# Altium schematic sheet power.SchDoc
size A4
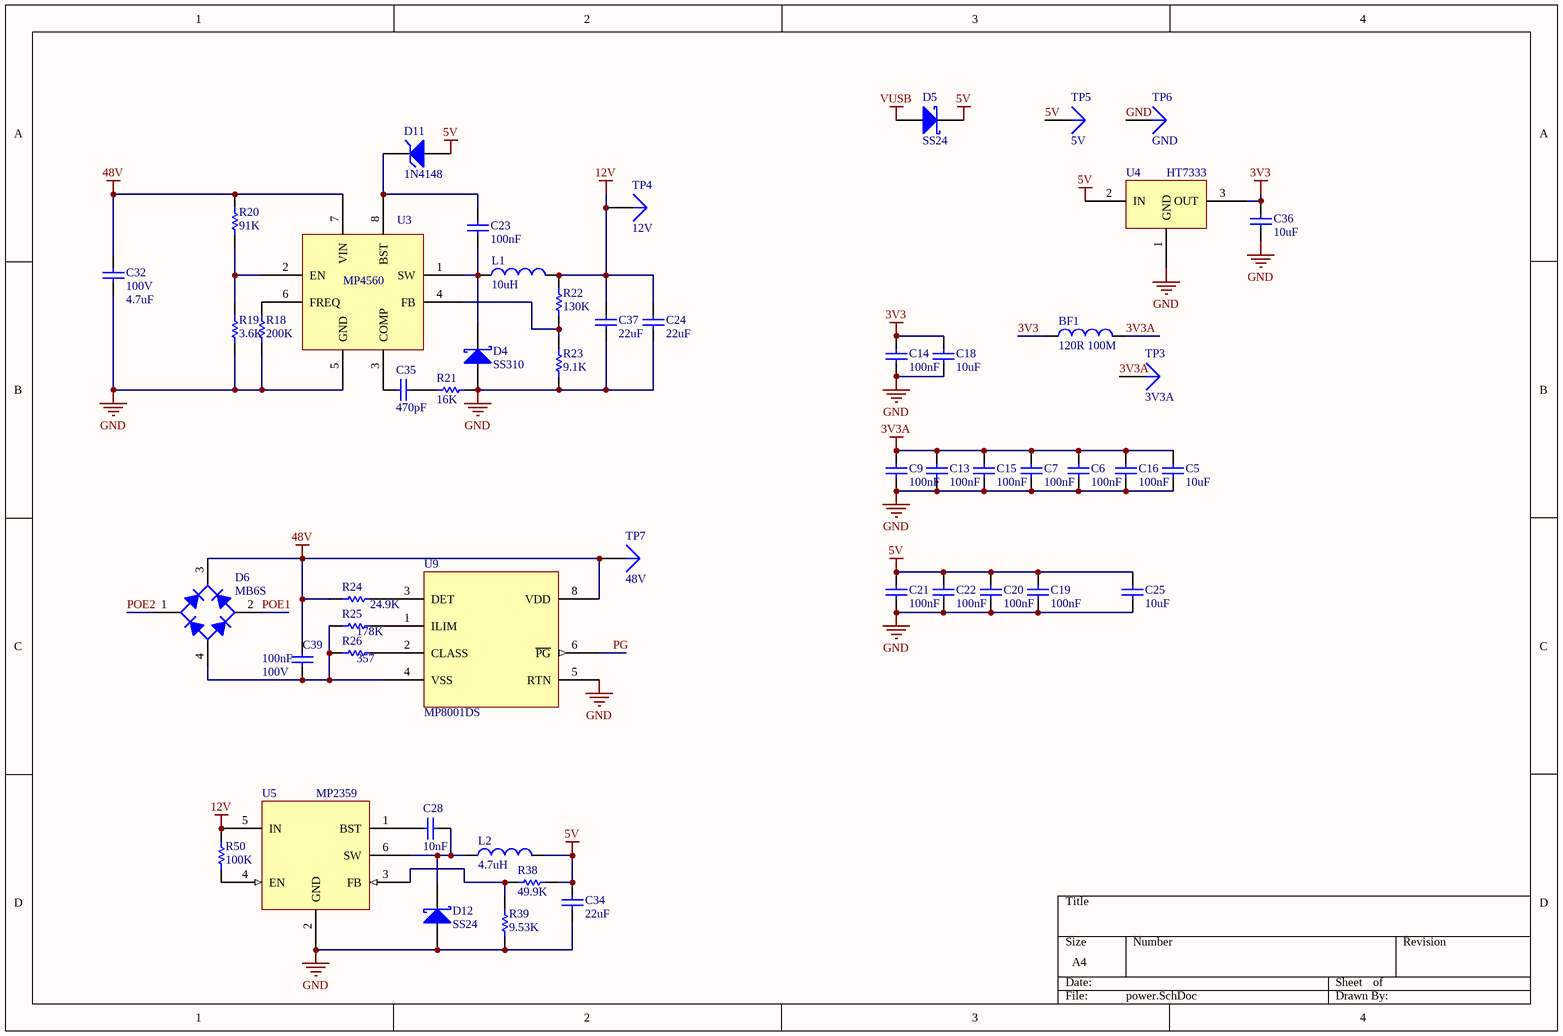
[diagram p0: power.SchDoc]

## Parts
BF1  value 120R 100M  [L-1608[0603]]  (hidden comment: GZ1608D121TF)
C5  value 10uF  [C-1608[0603]]  (hidden comment: Cap Semi)
C6  value 100nF  [C-1608[0603]]  (hidden comment: Cap Semi)
C7  value 100nF  [C-1608[0603]]  (hidden comment: Cap Semi)
C9  value 100nF  [C-1608[0603]]  (hidden comment: Cap Semi)
C13  value 100nF  [C-1608[0603]]  (hidden comment: Cap Semi)
C14  value 100nF  [C-1608[0603]]  (hidden comment: Cap Semi)
C15  value 100nF  [C-1608[0603]]  (hidden comment: Cap Semi)
C16  value 100nF  [C-1608[0603]]  (hidden comment: Cap Semi)
C18  value 10uF  [C-1608[0603]]  (hidden comment: Cap Semi)
C19  value 100nF  [C-1608[0603]]  (hidden comment: Cap Semi)
C20  value 100nF  [C-1608[0603]]  (hidden comment: Cap Semi)
C21  value 100nF  [C-1608[0603]]  (hidden comment: Cap Semi)
C22  value 100nF  [C-1608[0603]]  (hidden comment: Cap Semi)
C23  value 100nF  [C-1608[0603]]  (hidden comment: Cap Semi)
C24  value 22uF  [CAPC3225L]  (hidden comment: Cap Semi)
C25  value 10uF  [C-1608[0603]]  (hidden comment: Cap Semi)
C28  value 10nF  [C-1608[0603]]  (hidden comment: Cap Semi)
C32  100V  value 4.7uF  [CAPC3216L]
C34  value 22uF  [CAPC2512L]  (hidden comment: Tantalum)
C35  value 470pF  [C-1608[0603]]  (hidden comment: Cap Semi)
C36  value 10uF  [CAPC2512L]  (hidden comment: Tantalum)
C37  value 22uF  [CAPC3225L]  (hidden comment: Cap Semi)
C39  100V  value 100nF  [C-2012[0805]]
D4  SS310  [DO-214AC]
D5  SS24  [DO-214AC]
D6  MB6S  [MB6S]
D11  1N4148  [LL-34]
D12  SS24  [DO-214AC]
L1  value 10uH  [L-5040]  (hidden comment: Inductor)
L2  value 4.7uH  [INDC4532N]  (hidden comment: Inductor)
R18  value 200K  [R-1608[0603]]  (hidden comment: Res Semi)
R19  value 3.6K  [R-1608[0603]]  (hidden comment: Res Semi)
R20  value 91K  [R-1608[0603]]  (hidden comment: Res Semi)
R21  value 16K  [R-1608[0603]]  (hidden comment: Res Semi)
R22  value 130K  [R-1608[0603]]  (hidden comment: Res Semi)
R23  value 9.1K  [R-1608[0603]]  (hidden comment: Res Semi)
R24  value 24.9K  [R-2012[0805]]  (hidden comment: 1/4W)
R25  value 178K  [R-1608[0603]]  (hidden comment: Res Semi)
R26  value 357  [R-1608[0603]]  (hidden comment: Res Semi)
R38  value 49.9K  [R-1608[0603]]  (hidden comment: Res Semi)
R39  value 9.53K  [R-1608[0603]]  (hidden comment: Res Semi)
R50  value 100K  [R-1608[0603]]  (hidden comment: Res Semi)
TP3  3V3A  [TESTPOINT]
TP4  12V  [TESTPOINT]
TP5  5V  [TESTPOINT]
TP6  GND  [TESTPOINT]
TP7  48V  [TESTPOINT]
U3  MP4560  [MP1584]  (value not drawn)
U4  HT7333  [SOT89]
U5  MP2359  [SOT23-6]
U9  MP8001DS  [SOIC_E150_8]

## Nets
3V3: BF1.1 C14.2 C18.2 C36.1 U4.3(OUT)
3V3A: BF1.2 C5.2 C6.2 C7.2 C9.2 C13.2 C15.2 C16.2 TP3.1
5V: C19.2 C20.2 C21.2 C22.2 C25.2 C34.1 D5.2(K) D11.1(A) L2.2 R38.1 TP5.1 U4.2(IN)
12V: C24.1 C37.1 L1.2 R22.2 R50.1 TP4.1 U5.5(IN)
48V: C32.2 C39.2 D6.3(K) R20.2 R24.2 TP7.1 U3.7(VIN) U9.8(VDD)
GND: C5.1 C6.1 C7.1 C9.1 C13.1 C14.1 C15.1 C16.1 C18.1 C19.1 C20.1 C21.1 C22.1 C24.2 C25.1 C32.1 C34.2 C36.2 C37.2 D4.1(A) D12.1(A) R18.1 R19.1 R21.1 R23.1 R39.1 TP6.1 U3.5(GND) U4.1(GND) U5.2(GND) U9.5(RTN)
VUSB: D5.1(A)
PG: U9.6(~{PG})
POE1: D6.2(C)
POE2: D6.1(C)
NetC23_1: C23.1 D4.2(K) L1.1 U3.1(SW)
NetC23_2: C23.2 D11.2(K) U3.8(BST)
NetC28_1: C28.1 U5.1(BST)
NetC28_2: C28.2 D12.2(K) L2.1 U5.6(SW)
NetC35_1: C35.1 U3.3(COMP)
NetC35_2: C35.2 R21.2
NetC39_1: C39.1 D6.4(A) R25.2 R26.2 U9.4(VSS)
NetR18_2: R18.2 U3.6(FREQ)
NetR19_2: R19.2 R20.1 U3.2(EN)
NetR22_1: R22.1 R23.2 U3.4(FB)
NetR24_1: R24.1 U9.3(DET)
NetR25_1: R25.1 U9.1(ILIM)
NetR26_1: R26.1 U9.2(CLASS)
NetR38_2: R38.2 R39.2 U5.3(FB)
NetR50_2: R50.2 U5.4(EN)

## Library data of the parts
BF1 L1 L2 = Inductor: Code_IEC: 1005; Published: 8-Jun-2000; LatestRevisionDate: 29-May-2009; LatestRevisionNote: IPC-7351 Footprint Added.; PackageReference: 0402-A; Publisher: Altium Limited; PackageDescription: Chip Inductor; Code_JEITA: 0402
C5-C7 C9 C13-C16 C18-C25 C28 C32 C34-C37 C39 = Cap Semi: Capacitor (Semiconductor SIM Model); Published: 8-Jun-2000; LatestRevisionDate: 29-May-2009; LatestRevisionNote: IPC-7351 Footprint Added.; PackageReference: C1206; Publisher: Altium Limited; PackageDescription: Chip Capacitor
D4 D5 D12 = D Schottky: Schottky Diode; Published: 8-Jun-2000; LatestRevisionDate: 17-Jul-2002; LatestRevisionNote: Re-released for DXP Platform.; PackageReference: SMB; Publisher: Altium Limited; Code_JEDEC: DO-214-AA
D6 = Bridge1: Full Wave Diode Bridge; Published: 8-Jun-2000; LatestRevisionDate: 29-May-2009; LatestRevisionNote: Sch pins A & K swapped.; DatasheetVersion: E2732B; PackageReference: D-38; Publisher: Altium Limited
D11 = D Zener: Zener Diode; Published: 8-Jun-2000; LatestRevisionDate: 17-Jul-2002; LatestRevisionNote: Re-released for DXP Platform.; PackageReference: DIODE-0.7; Publisher: Altium Limited
R18-R26 R38 R39 R50 = Res Semi: Semiconductor Resistor; Published: 8-Jun-2000; LatestRevisionDate: 17-Jul-2002; LatestRevisionNote: Re-released for DXP Platform.; PackageReference: AXIAL-0.5; Publisher: Altium Limited
TP3-TP7 = Plug: LatestRevisionDate: 17-Jul-2002; LatestRevisionNote: Re-released for DXP Platform.; Publisher: Altium Limited
U3 = MP4560: 2A, 2MHz, 55V Step-Down Converter
U4 = HT73XX: Low Power Consumption LDO
U5 = MP2359: 1.2A, 24V, 1.4MHz  Step-Down Converter
U9 = MP8001